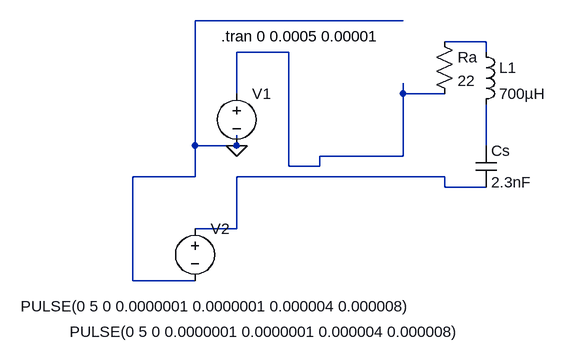
[diagram p0: schematic LC_125Khz.asc]
LC_125Khz.asc, the LTspice schematic file:
Version 4
SHEET 1 880 680
WIRE 288 32 -32 32
WIRE 416 64 352 64
WIRE 112 80 32 80
WIRE 416 80 416 64
WIRE 32 144 32 80
WIRE 288 144 288 128
WIRE 352 144 288 144
WIRE -32 224 -32 32
WIRE 32 224 32 208
WIRE 32 224 -32 224
WIRE 416 224 416 160
WIRE 288 240 288 144
WIRE 288 240 160 240
WIRE 112 256 112 80
WIRE 160 256 160 240
WIRE 160 256 112 256
WIRE -32 272 -32 224
WIRE -32 272 -128 272
WIRE 352 272 32 272
WIRE 352 288 352 272
WIRE 416 288 352 288
WIRE 32 352 32 272
WIRE 32 352 -32 352
WIRE -128 432 -128 272
WIRE -32 432 -128 432
FLAG 32 224 0
SYMBOL voltage 32 128 R0
WINDOW 3 -332 343 Left 2
SYMATTR Value PULSE(0 5 0 0.0000001 0.0000001 0.000004 0.000008)
SYMATTR InstName V1
SYMBOL ind 400 64 R0
SYMATTR InstName L1
SYMATTR Value 700µH
SYMATTR SpiceLine Rser=0.183
SYMBOL res 336 48 R0
SYMATTR InstName Ra
SYMATTR Value 22
SYMBOL cap 400 224 R0
SYMATTR InstName Cs
SYMATTR Value 2.3nF
SYMBOL voltage -32 336 R0
WINDOW 3 -193 174 Left 2
SYMATTR Value PULSE(0 5 0 0.0000001 0.0000001 0.000004 0.000008)
SYMATTR InstName V2
TEXT 8 56 Left 2 !.tran 0 0.0005 0.00001

The netlist it stands for:
* LC_125Khz.asc
V1 N002 0 PULSE(0 5 0 0.0000001 0.0000001 0.000004 0.000008)
L1 N001 N003 700µH Rser=0.183
Ra N001 N002 22
Cs N003 N004 2.3nF
V2 N004 0 PULSE(0 5 0 0.0000001 0.0000001 0.000004 0.000008)
.tran 0 0.0005 0.00001
.backanno
.end